# EAGLE design SAMD21E_Uno_unit (EAGLE 7.1.0)
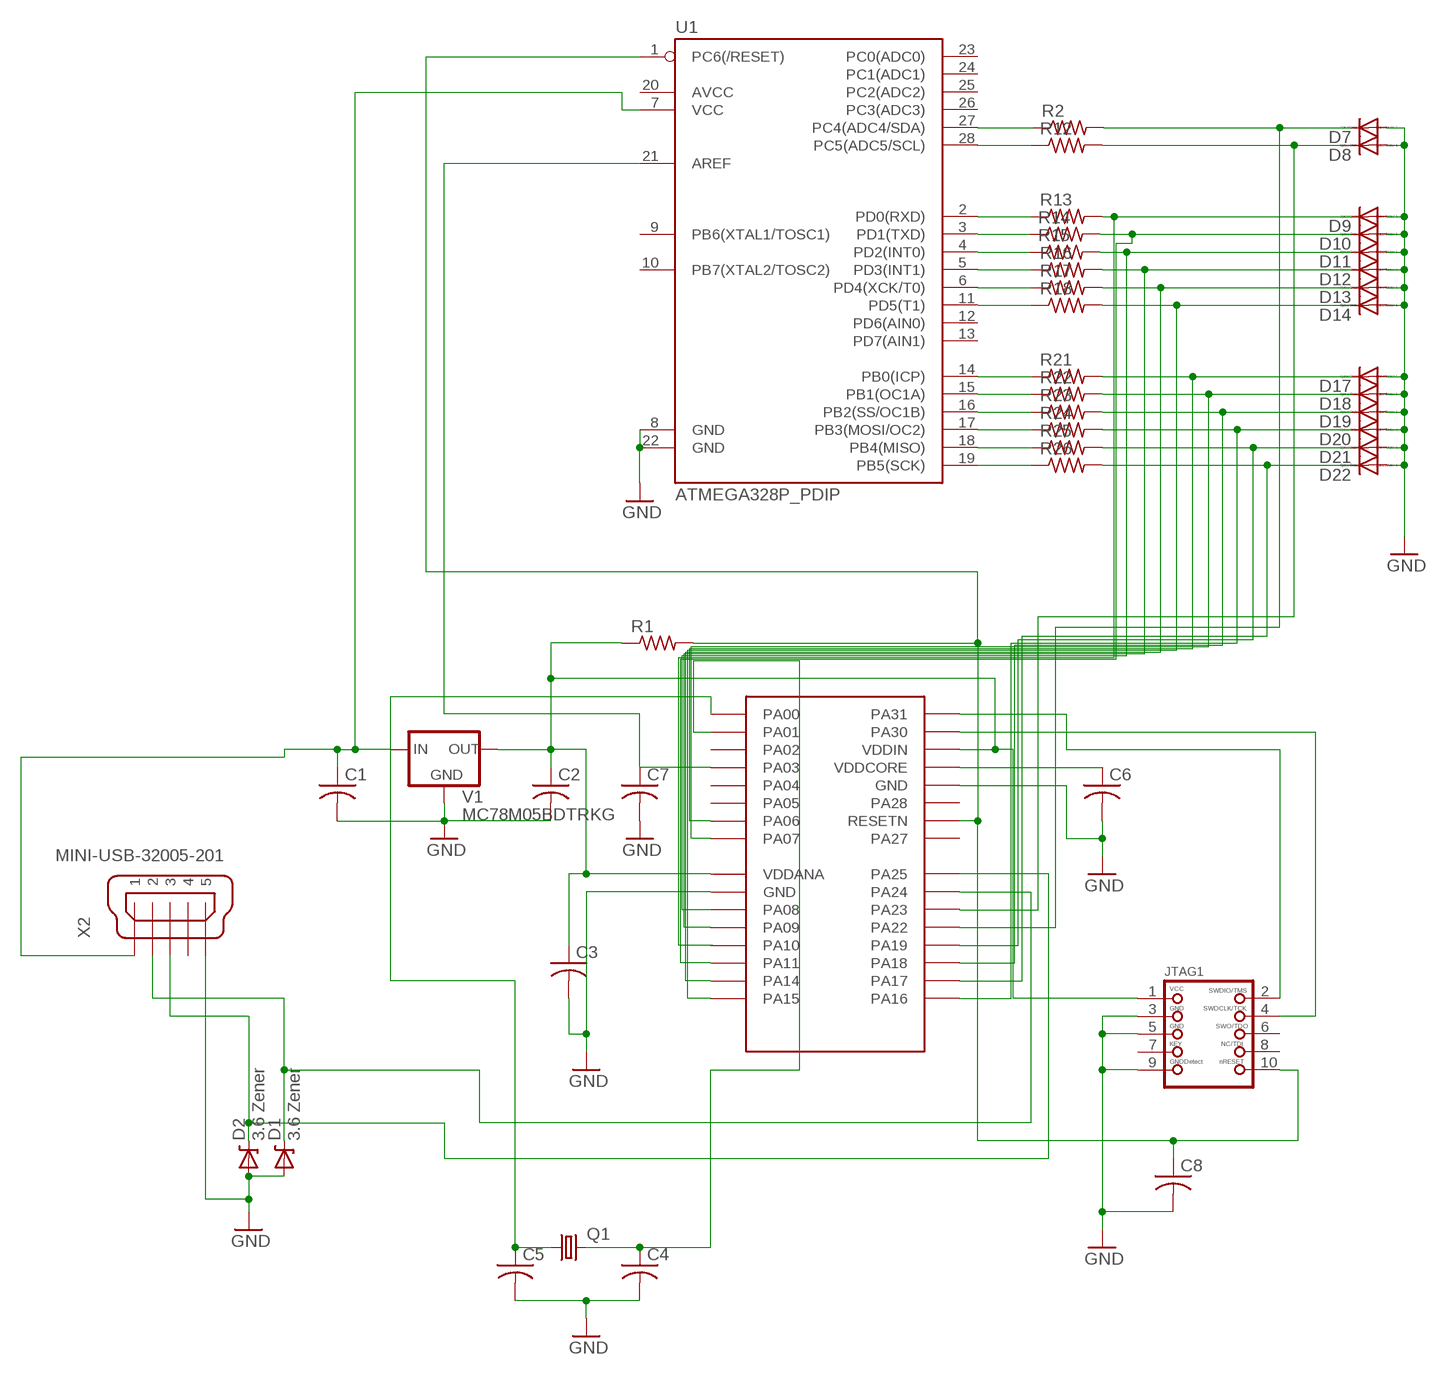
[diagram p0: schematic, sheet 1]

## Parts
C1  C-USC0603K  [C0603K]
C2  C-USC0603K  [C0603K]
C3  C-USC0603  [C0603]
C4  C-USC0603K  [C0603K]
C5  C-USC0603K  [C0603K]
C6  C-USC0603K  [C0603K]
C7  C-USC0603K  [C0603K]
C8  C-USC0603K  [C0603K]
D1  3.6 Zener  DIODE-ZENER-BZT52  [SOD-323]
D2  3.6 Zener  DIODE-ZENER-BZT52  [SOD-323]
D7  DIODE-SOD323-W  [SOD323-W]
D8  DIODE-SOD323-W  [SOD323-W]
D9  DIODE-SOD323-W  [SOD323-W]
D10  DIODE-SOD323-W  [SOD323-W]
D11  DIODE-SOD323-W  [SOD323-W]
D12  DIODE-SOD323-W  [SOD323-W]
D13  DIODE-SOD323-W  [SOD323-W]
D14  DIODE-SOD323-W  [SOD323-W]
D17  DIODE-SOD323-W  [SOD323-W]
D18  DIODE-SOD323-W  [SOD323-W]
D19  DIODE-SOD323-W  [SOD323-W]
D20  DIODE-SOD323-W  [SOD323-W]
D21  DIODE-SOD323-W  [SOD323-W]
D22  DIODE-SOD323-W  [SOD323-W]
JTAG1  JTAG-CORTEXM3  [2X05_1.27MM_SMT]
Q1  CRYSTALHC49UP  [HC49UP]
R1  R-US_R0603  [R0603]
R2  R-US_R0603  [R0603]
R12  R-US_R0603  [R0603]
R13  R-US_R0603  [R0603]
R14  R-US_R0603  [R0603]
R15  R-US_R0603  [R0603]
R16  R-US_R0603  [R0603]
R17  R-US_R0603  [R0603]
R18  R-US_R0603  [R0603]
R21  R-US_R0603  [R0603]
R22  R-US_R0603  [R0603]
R23  R-US_R0603  [R0603]
R24  R-US_R0603  [R0603]
R25  R-US_R0603  [R0603]
R26  R-US_R0603  [R0603]
U1  ATMEGA328P_PDIP  [DIL28-3]
U$8  ATSAMD21E18A-AU  [32-TQFP]
V1  MC78M05BDTRKG  LP2950CDT-3.0  [DPACK]
X2  MINI-USB-32005-201  [32005-201]

## Nets
GND: C1.2 C2.2 C3.2 C4.2 C5.2 C6.2 C7.2 C8.2 D1.2(A) D2.2(A) D7.A D8.A D9.A D10.A D11.A D12.A D13.A D14.A D17.A D18.A D19.A D20.A D21.A D22.A JTAG1.3 JTAG1.5 JTAG1.9 U1.8(GND) U1.22(GND) U$8.10(GND) U$8.28(GND) V1.4(GND) X2.5
N$1: C2.1 C3.1 JTAG1.1 R1.1 U$8.9(VDDANA) U$8.30(VDDIN) V1.3(OUT)
N$2: JTAG1.4 U$8.31(PA30)
N$3: C4.1 Q1.2 U$8.2(PA01)
N$4: JTAG1.2 U$8.32(PA31)
N$5: C5.1 Q1.1 U$8.1(PA00)
N$7: C8.1 JTAG1.10 R1.2 U1.1(PC6(/RESET)) U$8.26(RESETN)
N$8: C6.1 U$8.29(VDDCORE)
N$10: D1.1(C) U$8.23(PA24) X2.2
N$11: D2.1(C) U$8.24(PA25) X2.3
N$12: C7.1 U1.21(AREF) U$8.4(PA03)
N$13: R2.1 U1.27(PC4(ADC4/SDA))
N$16: C1.1 U1.7(VCC) V1.1(IN) X2.1
N$28: R12.1 U1.28(PC5(ADC5/SCL))
N$29: R13.1 U1.2(PD0(RXD))
N$30: R14.1 U1.3(PD1(TXD))
N$31: R15.1 U1.4(PD2(INT0))
N$32: R16.1 U1.5(PD3(INT1))
N$33: R17.1 U1.6(PD4(XCK/T0))
N$34: R18.1 U1.11(PD5(T1))
N$37: R21.1 U1.14(PB0(ICP))
N$38: R22.1 U1.15(PB1(OC1A))
N$39: R23.1 U1.16(PB2(SS/OC1B))
N$40: R24.1 U1.17(PB3(MOSI/OC2))
N$41: R25.1 U1.18(PB4(MISO))
N$42: R26.1 U1.19(PB5(SCK))
N$47: D7.C R2.2 U$8.21(PA22)
N$48: D8.C R12.2 U$8.22(PA23)
N$49: D9.C R13.2
N$50: D10.C R14.2 U$8.14(PA11)
N$51: D11.C R15.2 U$8.11(PA08)
N$52: D12.C R16.2 U$8.12(PA09)
N$53: D13.C R17.2 U$8.15(PA14)
N$54: D14.C R18.2 U$8.16(PA15)
N$57: D17.C R21.2 U$8.7(PA06)
N$58: D18.C R22.2 U$8.8(PA07)
N$59: D19.C R23.2 U$8.19(PA18)
N$60: D20.C R24.2 U$8.17(PA16)
N$61: D21.C R25.2 U$8.20(PA19)
N$62: D22.C R26.2 U$8.18(PA17)
Unconnected: JTAG1.6 JTAG1.7 JTAG1.8 U1.9(PB6(XTAL1/TOSC1)) U1.10(PB7(XTAL2/TOSC2)) U1.12(PD6(AIN0)) U1.13(PD7(AIN1)) U1.20(AVCC) U1.23(PC0(ADC0)) U1.24(PC1(ADC1)) U1.25(PC2(ADC2)) U1.26(PC3(ADC3)) U$8.3(PA02) U$8.5(PA04) U$8.6(PA05) U$8.13(PA10) U$8.25(PA27) U$8.27(PA28) X2.4

## Library data of the parts
C1 C2 C6-C8 = rcl:C-US: CAPACITOR, American symbol
C3-C5 = resistor:C-US: CAPACITOR, American symbol
D1 D2 = SparkFun:DIODE-ZENER: Zener Diode Production Part - 8199 3.4V Zener Voltage
D7-D14 D17-D22 = diode:DIODE-: DIODE
JTAG1 = OLED_mod:JTAG-CORTEXM3: Serial Wire (SW-DP) Connector This standard 0.05" 10-pin connector is for use with the Cortex M0/M3's native SWD (serial wire debugger) interface (SW-DP). Some boards support a 20-pin combined JTAG+SWD connector (SWJ-DP), such as the LPC1700 family, but many smaller devices only work with SWD which typically use the smaller 10-pin SW-DP connecter (the LPC1300 family, for example, only supports SWD). 2x05 1.27mm/0.05" Connector: This is the standard SMT connector defined by ARM for all Cortex devices, and should be used in most situations and for forward-compatibility since any new devices coming to market will likely use this connector. MOLEX 10 Pin 0.1" Connector: This 0.1" 10 pin connector has the same pin layout as the standard 0.05" connector, but is easier to work with if you are using standard jumper wires or custom cables to connect your SWD hardware. MOLEX 20 Pin 0.1" Connector: This 0.1" 20 pin connector is the same model used for ARM7/ARM9 JTAG debuggers, but is connected to match the pins on the Segger J-Link for ARM (which supports both JTAG and SWD debugging). See the following document from ARM for more information on Cortex M3 Debug Connectors: http://infocenter.arm.com/help/topic/com.arm.doc.faqs/attached/13634/cortex_debug_connectors.pdf And the following page for an overview with images of the different connector types: http://www.keil.com/peripherals/coresight/connectors.asp
Q1 = crystal:CRYSTAL: CRYSTAL; OC_FARNELL: unknown; OC_NEWARK: unknown
R1 = rcl:R-US_: RESISTOR, American symbol
R2 R12-R18 R21-R26 = resistor:R-US_: RESISTOR, American symbol
U1 = SparkFun-DigitalIC:ATMEGA328P_PDIP: uC used in the Arduino 32kb flash, 1k EEPROM, 2k SRAM This is the through-hole version of this chip.
U$8 = atmel-samd21:ATSAMD21E18A-AU
V1 = v-reg:LP2950?*: Source: http://cache.national.com/ds/LP/LP2950.pdf
X2 = con-cypressindustries:MINI-USB-: MINI USB-B Conector Source: www.cypressindustries.com; OC_FARNELL: unknown; OC_NEWARK: unknown

## Board
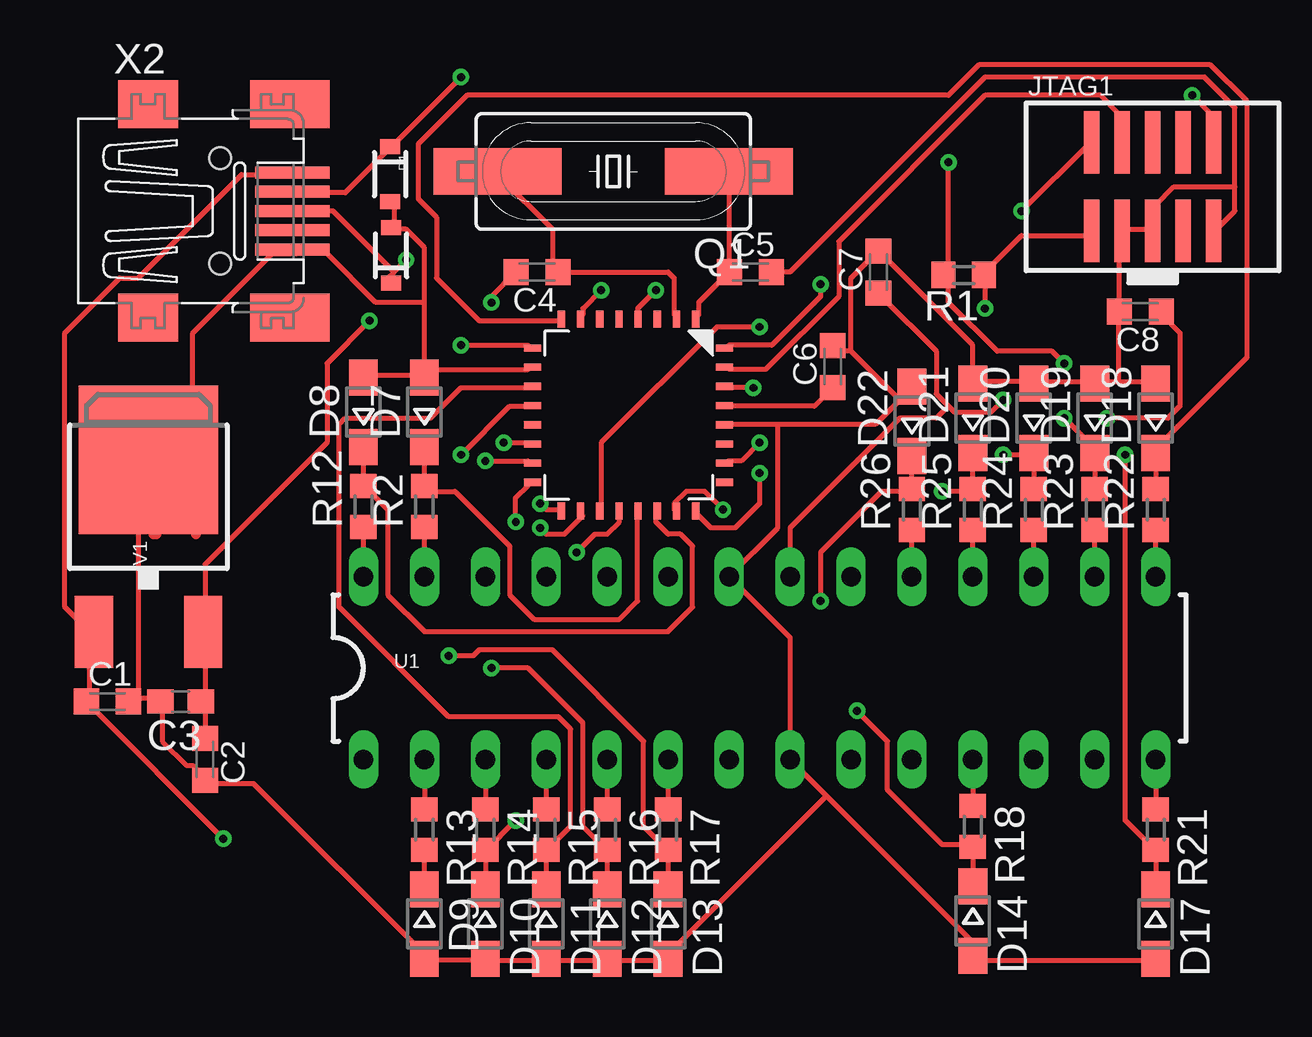
[diagram p1: board, top side]
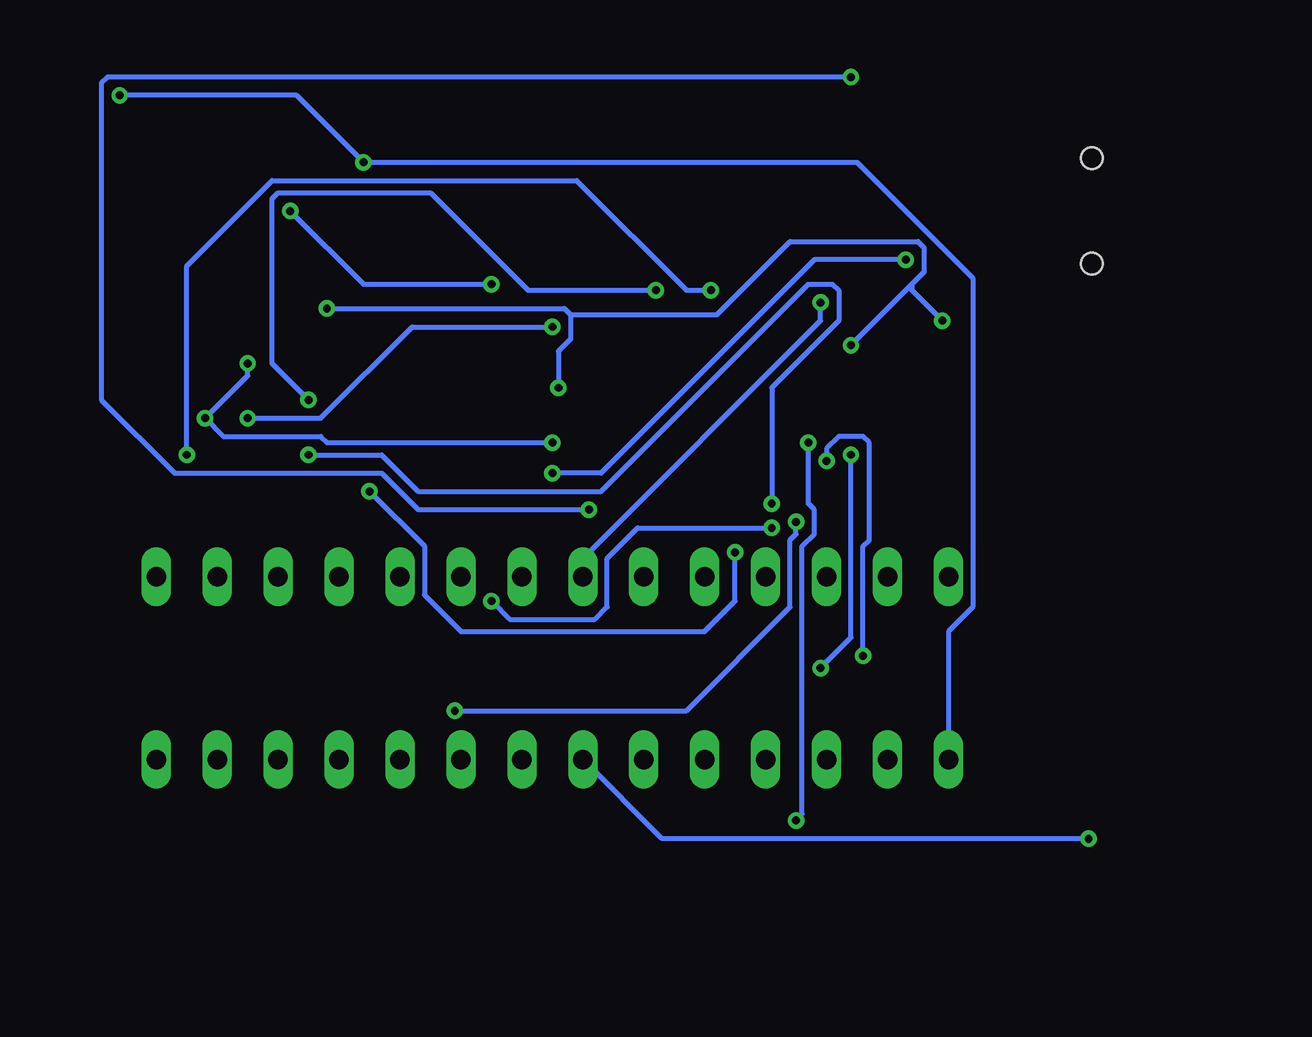
[diagram p2: board, bottom side, seen from below]

No outline drawn. Coordinates in mm, seen from the top.
Copper layers (1*16): Top 0.0356mm / dielectric 1.5011mm / Bottom 0.0356mm
Design rules "default": minimum track width 8mil, minimum drill 13mil, track to track 12mil, track to pad 12mil, pad to pad 12mil, via to via 12mil, smd to smd 8mil, copper to edge 15mil, drill to drill 12mil, minimum pad ring 7mil, minimum via ring 7mil, stop-mask expansion 4mil, vias tented up to drill 25mil, thermal gap 10mil
vRestrict: area 33.3,34.3 to 40.1,41.3

### Footprints (pad centres in the part's own frame; a part is rotated, then mirrored left to right if it is on the bottom)
C0603K = smd 1.05 x 1.08: 1 -0.875,0; 2 0.875,0
C0603 = smd 1.1 x 1: 1 -0.85,0; 2 0.85,0
SOD-323 = smd 0.63 x 0.83: 1 -1.15,0; 2 1.15,0
SOD323-W = smd 1.5 x 1.2: A 1.45,0; C -1.45,0
2X05_1.27MM_SMT = smd 0.65 x 2.6: 1 -2.54,-1.85; 2 -2.54,1.85; 3 -1.27,-1.85; 4 -1.27,1.85; 5 0,-1.85; 6 0,1.85; 7 1.27,-1.85; 8 1.27,1.85; 9 2.54,-1.85; 10 2.54,1.85
HC49UP = smd 5.334 x 1.93: 1 -4.826,0; 2 4.826,0
R0603 = smd 1 x 1.1: 1 -0.85,0; 2 0.85,0
DIL28-3 = drill 0.813 long: 1 -16.51,-3.81; 2 -13.97,-3.81; 3 -11.43,-3.81; 4 -8.89,-3.81; 5 -6.35,-3.81; 6 -3.81,-3.81; 7 -1.27,-3.81; 8 1.27,-3.81; 9 3.81,-3.81; 10 6.35,-3.81; 11 8.89,-3.81; 12 11.43,-3.81; 13 13.97,-3.81; 14 16.51,-3.81; 15 16.51,3.81; 16 13.97,3.81; 17 11.43,3.81; 18 8.89,3.81; 19 6.35,3.81; 20 3.81,3.81; 21 1.27,3.81; 22 -1.27,3.81; 23 -3.81,3.81; 24 -6.35,3.81; 25 -8.89,3.81; 26 -11.43,3.81; 27 -13.97,3.81; 28 -16.51,3.81
32-TQFP = smd 0.7 x 0.3: 1 -4,2.8; 2 -4,2; 3 -4,1.2; 4 -4,0.4; 5 -4,-0.4; 6 -4,-1.2; 7 -4,-2; 8 -4,-2.8; 17 4,-2.8; 18 4,-2; 19 4,-1.2; 20 4,-0.4; 21 4,0.4; 22 4,1.2; 23 4,2; 24 4,2.8 | smd 0.3 x 0.7: 9 -2.8,-4; 10 -2,-4; 11 -1.2,-4; 12 -0.4,-4; 13 0.4,-4; 14 1.2,-4; 15 2,-4; 16 2.8,-4; 25 2.8,4; 26 2,4; 27 1.2,4; 28 0.4,4; 29 -0.4,4; 30 -1.2,4; 31 -2,4; 32 -2.8,4
DPACK = smd 1.6 x 3: 1 -2.28,-4.8; 3 2.28,-4.8 | smd 5.8 x 6.2: 4 0,2.38
32005-201 = smd 3.1 x 0.5: 1 3,1.6; 2 3,0.8; 3 3,0; 4 3,-0.8; 5 3,-1.6 | smd 2.5 x 2: M1 -3,-4.45; M2 -3,4.45 | smd 3.3 x 2: M3 2.9,4.45; M4 2.9,-4.45 | hole 0.9: 0,2.2; 0,-2.2

### Placement (x,y rotation side)
C1  14.99,25.78 0 top
C2  19.05,23.37 270 top
C3  18.03,25.78 180 top
C4  32.89,43.69 180 top
C5  41.78,43.69 0 top
C6  45.21,39.75 90 top
C7  47.12,43.69 90 top
C8  58.04,42.04 180 top
D1  26.76,47.77 270 top
D2  26.81,44.38 90 top
D7  28.19,37.85 90 top
D8  25.65,37.85 90 top
D9  28.19,16.51 270 top
D10  30.73,16.51 270 top
D11  33.27,16.51 270 top
D12  35.81,16.51 270 top
D13  38.35,16.51 270 top
D14  51.05,16.64 270 top
D17  58.67,16.51 270 top
D18  58.67,37.59 90 top
D19  56.13,37.59 90 top
D20  53.59,37.59 90 top
D21  51.05,37.59 90 top
D22  48.51,37.47 90 top
JTAG1  58.55,47.24 0 top
Q1  36.07,47.88 180 top
R1  50.67,43.56 180 top
R2  28.19,33.91 90 top
R12  25.65,33.91 90 top
R13  28.19,20.45 270 top
R14  30.73,20.45 270 top
R15  33.27,20.45 270 top
R16  35.81,20.45 270 top
R17  38.35,20.45 270 top
R18  51.05,20.57 270 top
R21  58.67,20.45 270 top
R22  58.67,33.78 90 top
R23  56.13,33.78 90 top
R24  53.59,33.78 90 top
R25  51.05,33.78 90 top
R26  48.51,33.78 90 top
U1  42.16,27.18 0 top
U$8  36.7,37.72 270 top
V1  16.69,33.48 0 top
X2  19.68,46.23 0 top

### Tracks (layer width: path | path; a pad name or v marks a point on that pad's centre or on a via)
GND  (via drill 0.33)
  Top 0.203: D1.2 26.92,46.48 26.92,45.72 D2.2 26.92,45.47 27.43,45.47 28.19,44.7 28.19,42.42 | 28.19,39.37 28.45,39.62 32.51,39.62 U$8.10 | 28.19,39.37 28.19,42.42 | 28.19,39.37 25.65,39.37 D8.A | 28.19,39.37 D7.A | 28.19,42.42 26.16,42.42 24.13,44.45 22.86,44.45 X2.5 22.61,44.45 21.84,44.45 18.54,41.15 18.54,37.85 16.76,36.07 V1.4 16.51,35.81 16.26,35.56 16.26,25.91 | 16.26,25.91 17.02,25.91 C3.2 17.27,25.65 17.27,24.13 18.29,23.11 18.54,23.11 19.05,22.61 C2.2 19.05,22.35 21.08,22.35 28.19,15.24 D9.A 28.19,14.99 30.73,14.99 | 16.26,25.91 16,25.91 C1.2 16.26,25.91 | C5.2 43.43,43.69 51.56,51.82 60.71,51.82 61.98,50.55 61.98,47.24 | 61.98,47.24 61.98,46.23 61.21,45.47 JTAG1.9 | 42.93,37.34 46.99,37.34 48.01,38.35 | 42.93,37.34 40.89,37.34 U$8.28 | 48.01,38.35 48.51,38.86 D22.A 48.01,38.35 | 45.97,40.39 45.21,40.39 C6.2 | 48.01,38.35 45.97,40.39 | 45.97,40.39 45.97,43.43 46.99,44.45 C7.2 47.24,44.45 51.05,40.64 51.05,39.12 | 53.59,39.12 51.05,39.12 | 53.59,39.12 56.13,39.12 | 53.59,39.12 D20.A | 56.13,39.12 57.15,39.12 | 57.15,39.12 58.67,39.12 D18.A | 56.13,39.12 D19.A | 57.15,39.12 57.15,41.91 C8.2 57.15,42.16 57.15,45.21 JTAG1.3 57.4,45.47 58.42,45.47 JTAG1.5 58.67,45.47 58.67,46.48 59.44,47.24 61.98,47.24 | 51.05,39.12 D21.A | 30.73,14.99 33.27,14.99 | 30.73,14.99 D10.A | 33.27,14.99 35.81,14.99 | 33.27,14.99 D11.A | 35.81,14.99 38.35,14.99 D13.A 38.35,15.24 44.96,21.84 | 35.81,14.99 D12.A | D17.A 58.67,14.99 51.05,14.99 D14.A 51.05,15.75 44.96,21.84 | v30.99,42.42 30.99,42.67 32,43.69 C4.2 | 44.96,21.84 U1.8 43.43,28.45 U1.22 42.93,33.02 42.93,37.34
  Bottom 0.203: v30.99,42.42 30.99,41.66 40.89,31.75 U1.22
N$1  (via drill 0.33)
  Top 0.203: C2.1 19.05,25.65 C3.1 19.05,25.91 19.05,28.45 V1.3 19.05,28.7 19.05,31.5 24.13,36.58 24.13,39.88 v25.91,41.66 | v41.91,38.86 40.89,38.86 U$8.30 | v51.56,42.16 51.56,43.43 R1.1 51.56,43.69 53.09,45.21 55.88,45.21 JTAG1.1 | v29.72,40.64 32.51,40.64 U$8.9
  Bottom 0.203: v41.91,38.86 41.91,40.39 41.4,40.89 41.4,41.91 | 41.4,41.91 41.66,42.16 v51.56,42.16 | 27.18,43.18 26.67,43.69 26.67,44.7 26.92,44.96 32.26,44.96 35.31,41.91 41.4,41.91 | 27.18,43.18 v29.72,40.64 | v25.91,41.66 27.18,42.93 27.18,43.18
N$2
  Top 0.203: U$8.31 40.89,39.62 42.42,39.62 45.47,42.67 45.47,44.96 51.56,51.05 56.39,51.05 57.15,50.29 57.15,49.28 JTAG1.4
N$3
  Top 0.203: U$8.2 38.61,41.91 38.61,43.43 38.35,43.69 C4.1 33.53,43.69 33.53,45.47 31.24,47.75 Q1.2
N$4  (via drill 0.33)
  Top 0.203: v44.7,43.18 44.7,42.67 42.67,40.64 40.89,40.64 U$8.32 | v53.09,46.23 55.88,49.02 JTAG1.2
  Bottom 0.203: v44.7,43.18 50.04,43.18 v53.09,46.23
N$5
  Top 0.203: 40.89,43.69 39.62,42.42 39.62,41.91 U$8.1 | Q1.1 40.89,43.69 | 40.89,43.69 C5.1
N$6
  Top 0.406: 17.02,32.77 16.89,32.77
N$7  (via drill 0.33)
  Top 0.203: v42.16,36.58 41.4,35.81 40.89,35.81 U$8.26 | v56.64,37.59 59.18,37.59 59.69,38.1 59.69,41.15 58.93,41.91 C8.1 | v54.86,39.88 54.36,40.39 52.07,40.39 50.04,42.42 50.04,43.43 R1.2 50.04,43.69 v50.04,48.26 | v60.2,51.05 60.96,50.29 60.96,49.28 JTAG1.10
  Bottom 0.203: v42.16,36.58 51.56,36.58 51.82,36.83 55.88,36.83 v56.64,37.59 54.86,39.37 v54.86,39.88 | U1.1 25.65,28.7 24.64,29.72 24.64,43.43 29.46,48.26 v50.04,48.26 52.83,51.05 v60.2,51.05
N$8
  Top 0.203: U$8.29 40.89,38.1 44.45,38.1 45.21,38.86 C6.1
N$9
  Top 0.406: 18.67,32.77 18.67,32.89
N$10  (via drill 0.33)
  Top 0.203: v40.64,33.78 39.88,34.54 39.12,34.54 38.61,34.04 38.61,33.78 U$8.23 | v29.72,51.82 26.92,49.02 D1.1 26.67,48.77 24.89,46.99 22.86,46.99 X2.2
  Bottom 0.203: v40.64,33.78 47.75,33.78 49.28,35.31 57.91,35.31 60.96,38.35 60.96,51.56 60.71,51.82 v29.72,51.82
N$11  (via drill 0.33)
  Top 0.203: v42.16,35.31 42.16,34.04 41.15,33.02 40.13,33.02 39.62,33.53 U$8.24 | 26.92,43.69 26.67,43.43 D2.1 | 26.92,43.69 v27.43,44.2 | X2.3 24.38,46.23 26.92,43.69
  Bottom 0.203: v42.16,35.31 40.13,35.31 31.24,44.2 v27.43,44.2
N$12  (via drill 0.33)
  Top 0.203: v37.85,42.93 37.08,42.16 37.08,41.91 U$8.4 | v52.32,38.35 51.82,37.85 50.29,37.85 50.04,38.1 | 50.04,38.1 49.53,38.61 49.53,40.39 47.24,42.67 C7.1 | U1.21 43.43,33.02 48.01,37.59 49.53,37.59 50.04,38.1
  Bottom 0.203: v37.85,42.93 43.18,42.93 47.24,46.99 53.59,46.99 53.85,46.74 53.85,39.88 v52.32,38.35
N$13
  Top 0.203: U1.27 R2.1
N$16  (via drill 0.33)
  Top 0.203: v19.81,20.07 14.22,25.65 C1.1 14.22,25.91 14.22,28.45 V1.1 14.22,28.7 13.21,29.72 13.21,41.15 15.49,43.43 16.26,43.43 20.57,47.75 22.61,47.75 X2.1
  Bottom 0.203: U1.7 37.59,20.07 v19.81,20.07
N$28
  Top 0.203: U1.28 R12.1
N$29
  Top 0.203: U1.2 R13.1
N$30
  Top 0.203: U1.3 R14.1
N$31
  Top 0.203: U1.4 R15.1
N$32
  Top 0.203: U1.5 R16.1
N$33
  Top 0.203: U1.6 R17.1
N$34
  Top 0.203: U1.11 R18.1
N$37
  Top 0.203: U1.14 R21.1
N$38
  Top 0.203: U1.15 R22.1
N$39
  Top 0.203: U1.16 R23.1
N$40
  Top 0.203: U1.17 R24.1
N$41
  Top 0.203: U1.18 R25.1
N$42
  Top 0.203: U1.19 R26.1
N$47
  Top 0.203: U$8.21 37.08,33.53 37.08,29.97 36.32,29.21 32.77,29.21 31.75,30.23 31.75,32.26 29.46,34.54 28.19,34.54 R2.2 D7.C
N$48
  Top 0.203: 25.65,34.8 26.67,33.78 26.67,30.23 28.19,28.7 38.35,28.7 39.37,29.72 39.37,32.26 38.86,32.77 38.35,32.77 37.85,33.27 37.85,33.53 U$8.22 | 25.65,34.8 D8.C | 25.65,34.8 R12.2
N$49
  Top 0.203: D9.C R13.2
N$50  (via drill 0.33)
  Top 0.203: v31.5,36.58 32.51,36.58 U$8.14 | 30.73,19.56 v32,20.83 | 30.73,19.56 D10.C | 30.73,19.56 R14.2
  Bottom 0.203: v31.5,36.58 31.5,34.04 31.24,33.78 31.24,32.77 31.75,32.26 31.75,21.08 v32,20.83
N$51
  Top 0.203: 33.27,19.56 34.29,20.57 34.29,24.64 33.78,25.15 29.21,25.15 24.64,29.72 24.64,37.34 24.89,37.59 28.45,37.59 29.72,38.86 32.51,38.86 U$8.11 | 33.27,19.56 D11.C | 33.27,19.56 R15.2
N$52  (via drill 0.33)
  Top 0.203: v29.72,36.07 31.75,38.1 32.51,38.1 U$8.12 | v30.99,27.18 32.51,27.18 34.8,24.89 34.8,20.57 35.81,19.56 | 35.81,19.56 D12.C | 35.81,19.56 R16.2
  Bottom 0.203: v29.72,36.07 29.72,28.45 v30.99,27.18
N$53  (via drill 0.33)
  Top 0.203: v30.73,35.81 32.51,35.81 U$8.15 | v29.21,27.69 30.23,27.69 30.48,27.94 33.53,27.94 37.34,24.13 37.34,20.57 38.35,19.56 | 38.35,19.56 D13.C | 38.35,19.56 R17.2
  Bottom 0.203: v30.73,35.81 30.73,36.32 30.23,36.83 29.21,36.83 28.96,36.58 28.96,32.51 29.21,32.26 v29.21,27.69
N$54  (via drill 0.33)
  Top 0.203: v32,33.27 32,34.29 32.51,34.8 U$8.16 | v46.23,25.4 47.5,24.13 47.5,22.1 49.78,19.81 51.05,19.81 R18.2 D14.C
  Bottom 0.203: v32,33.27 32,32.77 32.26,32.51 32.26,29.72 36.58,25.4 v46.23,25.4
N$57  (via drill 0.33)
  Top 0.203: v35.56,42.93 34.8,42.16 34.8,41.91 U$8.7 | v57.4,36.07 57.4,20.83 58.67,19.56 | 58.67,19.56 D17.C | 58.67,19.56 R21.2
  Bottom 0.203: v35.56,42.93 36.58,42.93 41.15,47.5 53.85,47.5 57.4,43.94 v57.4,36.07
N$58
  Top 0.203: U$8.8 33.78,41.66 30.48,41.66 28.7,43.43 28.7,45.97 27.94,46.74 27.94,49.02 29.97,51.05 50.04,51.05 51.31,52.32 60.96,52.32 62.48,50.8 62.48,40.13 58.67,36.32 D18.C R22.2
N$59  (via drill 0.33)
  Top 0.203: v42.16,41.4 40.39,41.4 35.56,36.58 35.56,33.78 U$8.19 | v54.86,37.59 56.13,36.32 D19.C R23.2
  Bottom 0.203: v42.16,41.4 48.01,41.4 51.82,37.59 v54.86,37.59
N$60  (via drill 0.33)
  Top 0.203: v33.02,34.04 33.27,33.78 33.78,33.78 U$8.17 | 53.59,36.07 v52.32,36.07 | 53.59,36.07 R24.2 | 53.59,36.07 D20.C
  Bottom 0.203: v33.02,34.04 33.02,38.86 30.23,41.66 30.23,42.93 30.48,43.18 31.5,43.18 40.13,34.54 47.75,34.54 49.28,36.07 v52.32,36.07
N$61  (via drill 0.33)
  Top 0.203: v34.54,32 35.31,32.77 35.81,32.77 36.32,33.27 36.32,33.53 U$8.20 | v49.78,34.54 51.05,34.54 R25.2 D21.C
  Bottom 0.203: v34.54,32 34.54,29.97 35.81,28.7 45.97,28.7 47.5,30.23 47.5,32.26 v49.78,34.54
N$62  (via drill 0.33)
  Top 0.203: v33.02,33.02 33.27,32.77 34.04,32.77 34.8,33.53 U$8.18 | v44.7,29.97 44.7,32 47.24,34.54 48.51,34.54 R26.2 D22.C
  Bottom 0.203: v33.02,33.02 38.61,33.02 39.88,31.75 39.88,29.72 40.39,29.21 43.94,29.21 v44.7,29.97